# EAGLE design rca_ribbon_adapter (EAGLE 5.12)
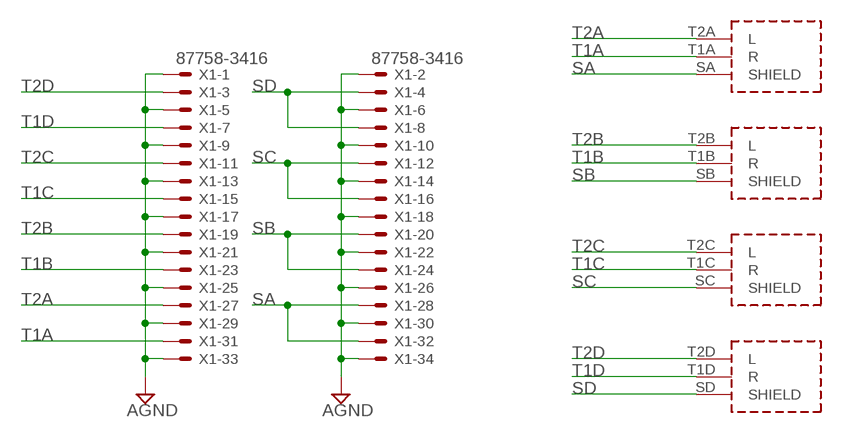
[diagram p0: schematic, sheet 1]

## Parts
J1  PJRAS4X2  [PJRAS4X2]
X1  87758-3416  [87758-3416]

## Nets
AGND: X1.1 X1.2 X1.5 X1.6 X1.9 X1.10 X1.13 X1.14 X1.17 X1.18 X1.21 X1.22 X1.25 X1.26 X1.29 X1.30 X1.33 X1.34
SA: J1.SA(SHIELD) X1.28 X1.32
SB: J1.SB(SHIELD) X1.20 X1.24
SC: J1.SC(SHIELD) X1.12 X1.16
SD: J1.SD(SHIELD) X1.4 X1.8
T1A: J1.T1A(R) X1.31
T1B: J1.T1B(R) X1.23
T1C: J1.T1C(R) X1.15
T1D: J1.T1D(R) X1.7
T2A: J1.T2A(L) X1.27
T2B: J1.T2B(L) X1.19
T2C: J1.T2C(L) X1.11
T2D: J1.T2D(L) X1.3

## Library data of the parts
J1 = cdp:PJRAS4X2
X1 = con-molex:87758-3416: 34 Pin - 2mm Dual Row Single Wafer, Vertical T/H HDR Source: http://www.molex.com/pdm_docs/sd/877580616_sd.pdf; MPN: 87758-3416; OC_FARNELL: unknown; OC_NEWARK: 25M5686

## Board
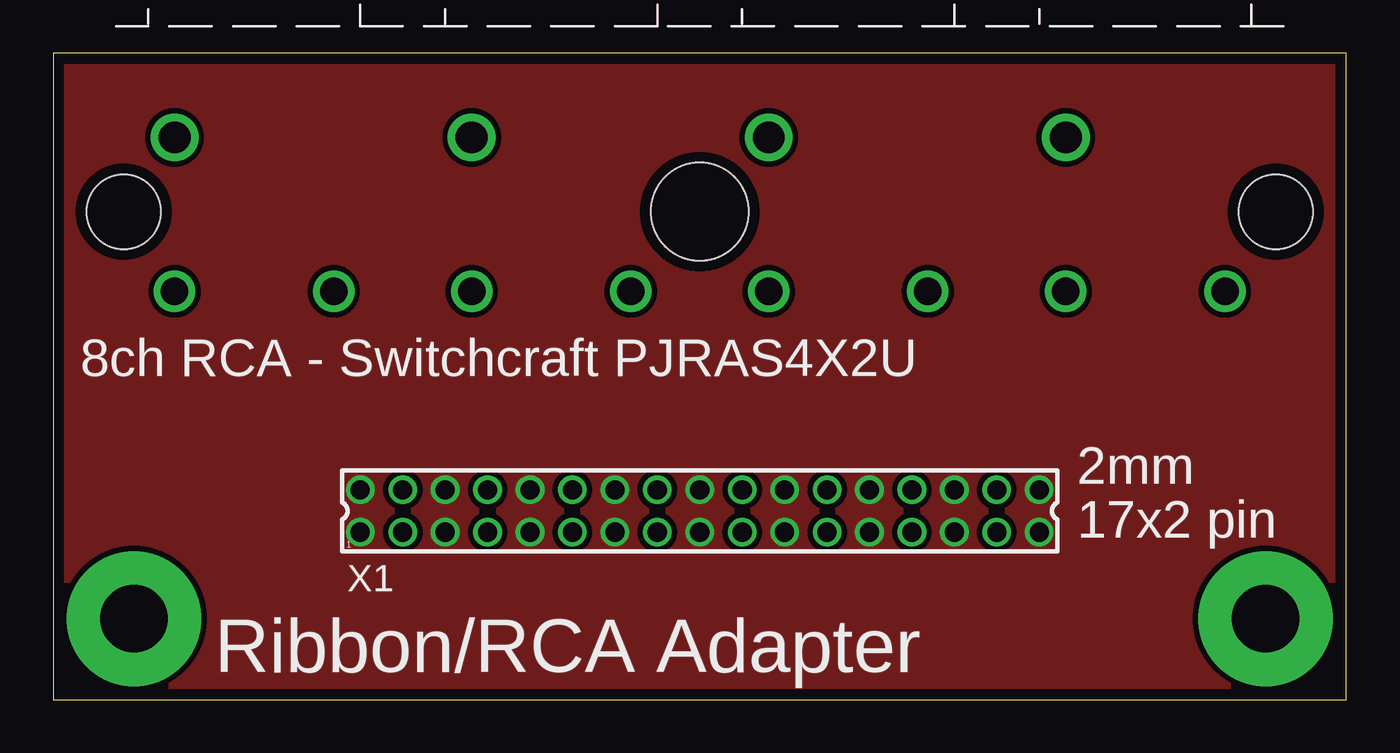
[diagram p1: board, top side]
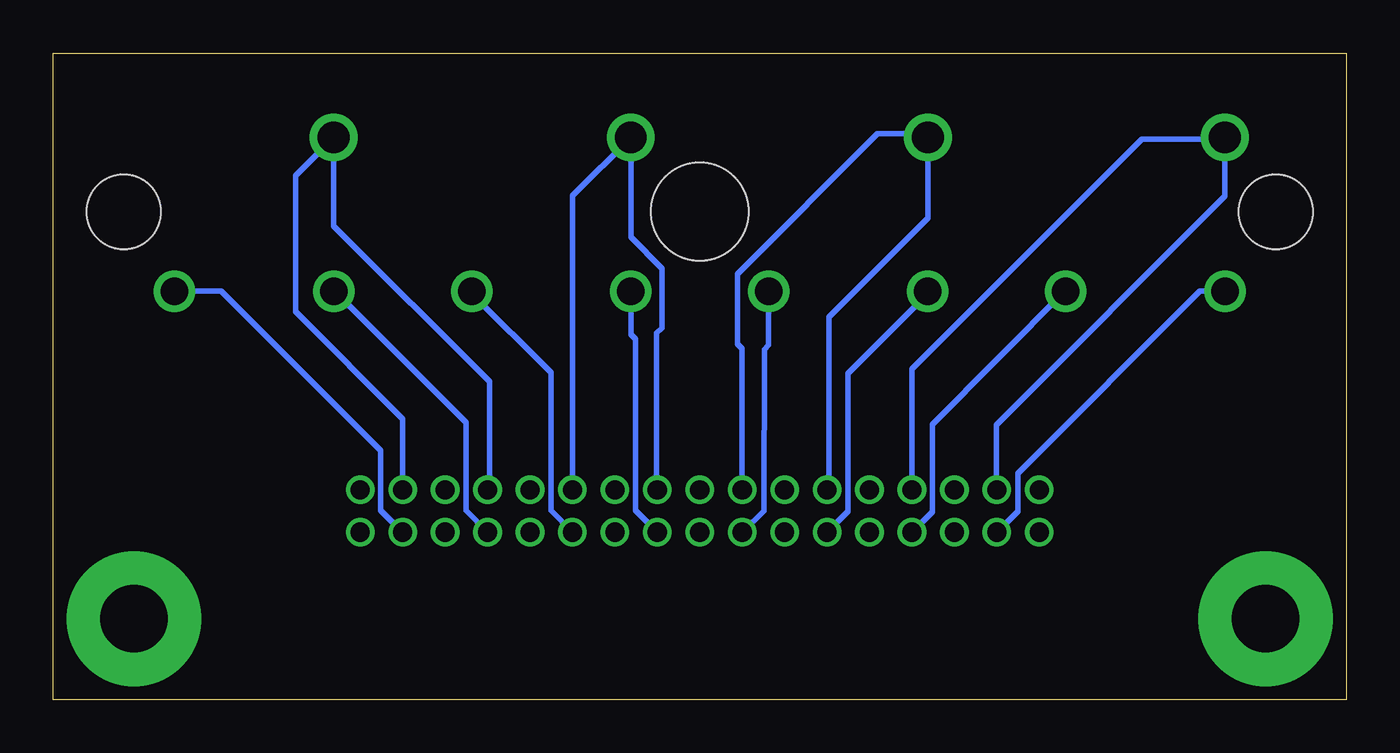
[diagram p2: board, bottom side, seen from below]

Size 60.96 x 30.48 mm. Coordinates in mm from the lower left corner, seen from the top.
Outline: 0,0 60.96,0 60.96,30.48 0,30.48 0,0
Copper layers (1*16): Top 0.035mm / dielectric 1.6mm / Bottom 0.035mm
Design rules "Elecrow_2-layer_PCB_eagle_rule": minimum track width 6mil, minimum drill 12mil, track to track 6mil, track to pad 6mil, pad to pad 6mil, via to via 8mil, smd to smd 0mil, copper to edge 20mil, drill to drill 10mil, minimum pad ring 6mil, minimum via ring 6mil, stop-mask expansion 0mil, vias tented up to drill 100mil, thermal gap 10mil

### Footprints (pad centres in the part's own frame; a part is rotated, then mirrored left to right if it is on the bottom)
PJRAS4X2 = drill 1.5 round: SA -17.25,5.25; SB -3.25,5.25; SC 10.75,5.25; SD 24.75,5.25 | drill 1.3 round: T1A -24.75,12.5; T1B -10.75,12.5; T1C 3.25,12.5; T1D 17.25,12.5; T2A -17.25,12.5; T2B -3.25,12.5; T2C 10.75,12.5; T2D 24.75,12.5 | hole 3.5: -27.15,8.75; 27.15,8.75 | hole 4.6: 0,8.75
87758-3416 = drill 0.9 pad 1.27 round: 1 -16,-1; 2 -16,1; 3 -14,-1; 4 -14,1; 5 -12,-1; 6 -12,1; 7 -10,-1; 8 -10,1; 9 -8,-1; 10 -8,1; 11 -6,-1; 12 -6,1; 13 -4,-1; 14 -4,1; 15 -2,-1; 16 -2,1; 17 0,-1; 18 0,1; 19 2,-1; 20 2,1; 21 4,-1; 22 4,1; 23 6,-1; 24 6,1; 25 8,-1; 26 8,1; 27 10,-1; 28 10,1; 29 12,-1; 30 12,1; 31 14,-1; 32 14,1; 33 16,-1; 34 16,1

### Placement (x,y rotation side)
J1  30.48,31.75 180 top
X1  30.48,8.89 0 top

### Tracks (layer width: path | path; a pad name or v marks a point on that pad's centre or on a via)
AGND
  pour Top (isolate 0.254, no thermals): 0,31.75 60.96,31.75 60.96,0 0,0
N$29  (via drill 3.17 pad 6.35)
  other vias: 3.81,3.81
N$30  (via drill 3.17 pad 6.35)
  other vias: 57.15,3.81
SA
  Bottom 0.254: X1.28 40.39,9.98 40.39,14.99 47.73,22.33 J1.SA 49.53,24.7 49.53,18.29 44.48,13.24 X1.32
SB
  Bottom 0.254: X1.20 32.51,9.92 32.51,17.27 32.26,17.53 32.26,20.32 33.73,21.79 J1.SB 36.48,23.75 X1.24
SC
  Bottom 0.254: X1.12 24.38,9.99 24.38,18.03 19.73,22.69 J1.SC 19.9,26.67 22.1,26.67 28.7,20.07 28.7,16.76 28.48,16.54 X1.16
SD
  Bottom 0.254: X1.4 16.51,9.92 16.51,12.95 5.73,23.73 J1.SD 5.81,26.42 9.65,26.42 20.48,15.59 X1.8
T1A
  Bottom 0.254: J1.T1A 53.03,19.25 45.52,11.73 45.52,8.93 X1.31
T1B
  Bottom 0.254: J1.T1B 41.23,19.13 37.49,15.42 37.49,8.93 X1.23
T1C
  Bottom 0.254: J1.T1C 27.23,16.71 27.43,16.51 27.46,8.89 X1.15
T1D
  Bottom 0.254: J1.T1D 13.26,19.25 19.51,12.98 19.51,8.84 X1.7
T2A
  Bottom 0.254: J1.T2A 47.7,19.25 41.5,13.06 41.5,8.91 X1.27
T2B
  Bottom 0.254: J1.T2B 33.73,17.22 33.5,16.99 33.5,8.91 X1.19
T2C
  Bottom 0.254: J1.T2C 19.73,19.13 23.5,15.37 23.5,8.88 X1.11
T2D
  Bottom 0.254: J1.T2D 6.91,19.25 15.49,10.67 15.49,8.88 X1.3

### Text on the board
tPlace: 8ch RCA - Switchcraft PJRAS4X2U | 2mm | 17x2 pin | Ribbon/RCA Adapter